# EasyEDA schematic flashlight-driver_2020-10-08_16-01-53.json
TITLE: Sheet_1; REV: 1.0; Date: 2020-08-26; Sheet: 1/1; Drawn By: Aleksi; Company: Your Company
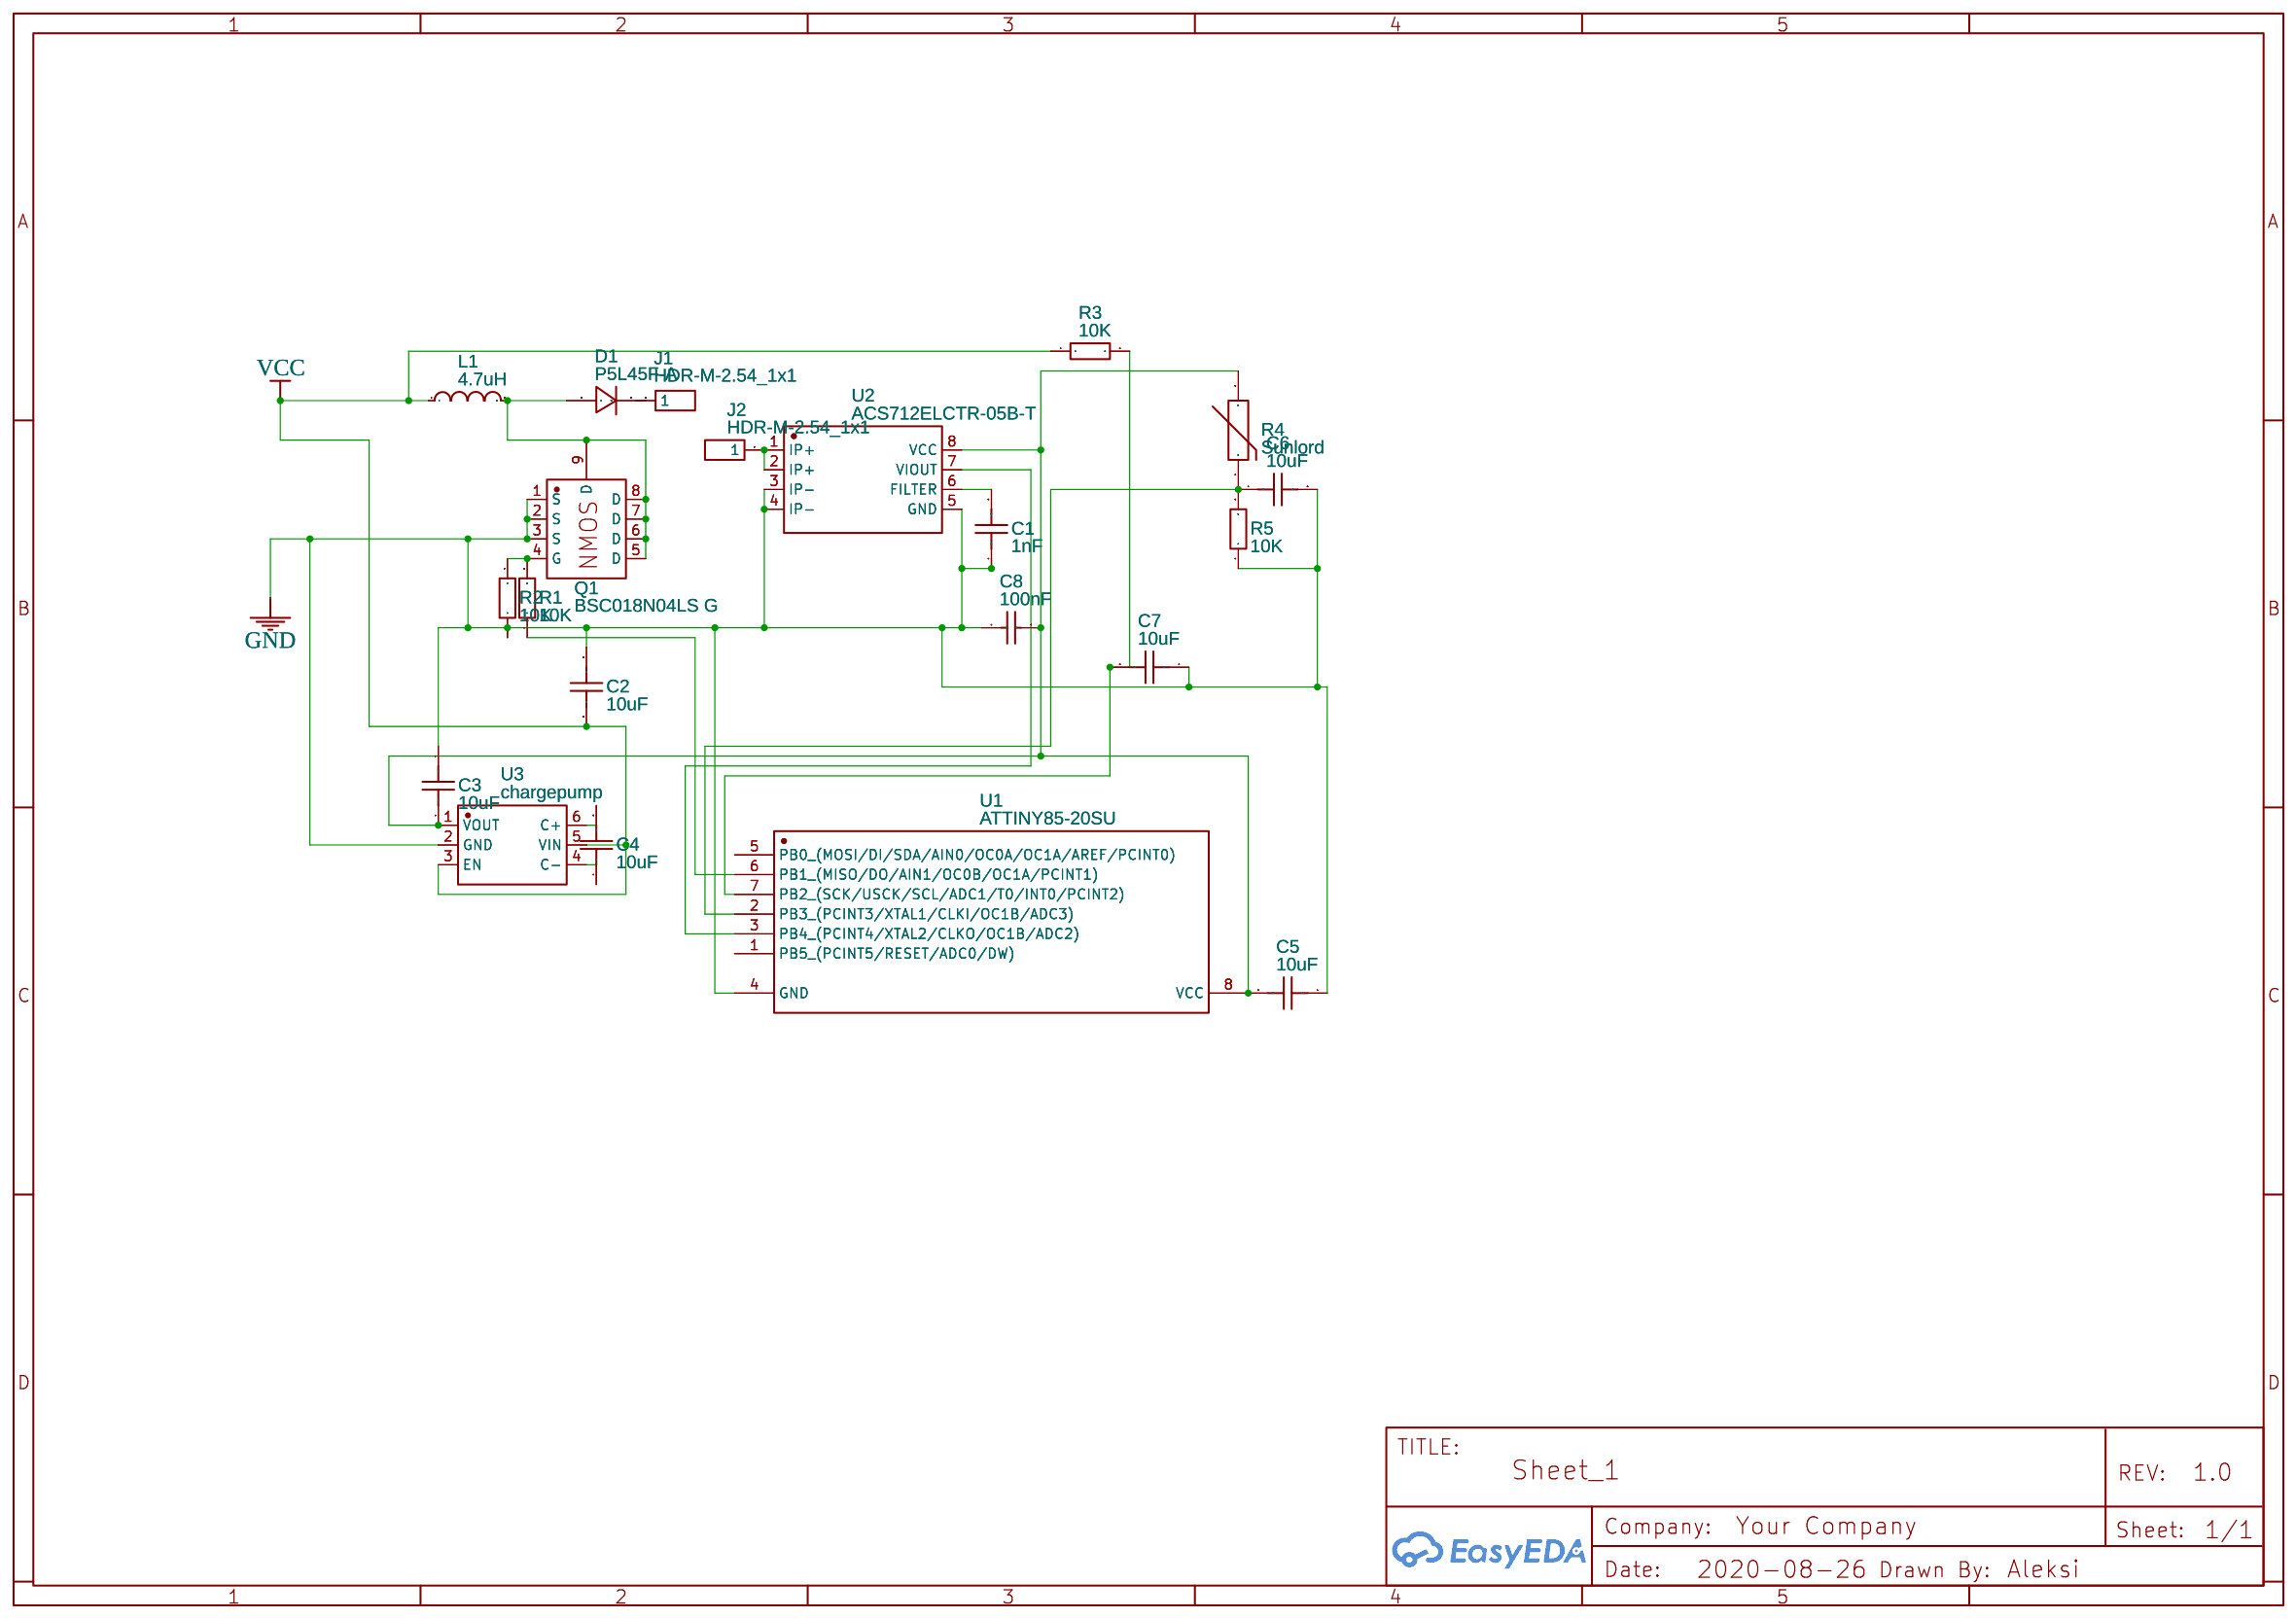
[diagram p0: schematic sheet]

## Parts
C1  1nF  [C0603]
C2  10uF  [C0603]
C3  10uF  [C0603]
C4  10uF  [C0603]
C5  10uF  [C0603]
C6  10uF  [C0603]
C7  10uF  [C0603]
C8  100nF  [C0603]
D1  P5L45F-A  [SMAF_L3.5-W2.6-LS4.7-FD]
J1  HDR-M-2.54_1x1  [HDR-M-2.54_1X1]
J2  HDR-M-2.54_1x1  [HDR-M-2.54_1X1]
L1  4.7uH  [IND-SMD_L13.8-W12.6_MHCC12050]
Q1  BSC018N04LS G  [PG-TDSON-8_L5.0-W6.0-P1.27-LS6.2-BL-EP]
R1  10K  [R0603]
R2  10K  [R0603]
R3  10K  [R0603]
R4  Sunlord  [R0603]
R5  10K  [R0603]
U1  ATTINY85-20SU  [SOIC-8_L5.3-W5.3-P1.27-LS8.0-BL]
U2  ACS712ELCTR-05B-T  [SOIC-8_L5.0-W4.0-P1.27-LS6.0-BL]
U3  chargepump  [SOT-23-6_L2.9-W1.6-P0.95-LS2.8-TL]

## Library data of the parts
C1 = GRM188R11H102KA01D: Supplier: LCSC; Manufacturer: MuRata; Supplier Part: C86007
C2-C7 = CL10A106KP8NNNC: Supplier: LCSC; Manufacturer: SAMSUNG; LCSC Assembly: Yes; Supplier Part: C19702; SMT Type: Basic
C8 = C0603C104K5RACAUTO: Supplier: LCSC; Manufacturer: KEMET; Supplier Part: C129621
D1 = P5L45F-A: Supplier: LCSC; Supplier Part: C255362; Manufacturer: PFC Device; Contributor: LCSC
J1 J2 = HDR-M-2.54_1x1: Supplier Part: C81276; Supplier: LCSC; Contributor: LCEDA_Lib
L1 = TMAX-1365-4R7-M: Supplier: LCSC; Supplier Part: C429830; Manufacturer: TDG; Contributor: LCSC
Q1 = BSC018N04LS G: Supplier: LCSC; Supplier Part: C534297; Manufacturer: Infineon Technologies; Contributor: LCSC
R1-R3 R5 = TC0350D1002T5E: Supplier: LCSC; Manufacturer: UniOhm; Supplier Part: C64266; LCSC Assembly: Yes; SMT Type: Extend
R4 = SDNT1608X103F3950FTF: Supplier: LCSC; Supplier Part: C279936; Contributor: LCSC
U1 = ATTINY85-20SU: Supplier: LCSC; Manufacturer: MICROCHIP; Supplier Part: C89852; LCSC Assembly: Yes; SMT Type: Extend
U2 = ACS712ELCTR-05B-T: Supplier: LCSC; Manufacturer: ALLEGRO; image: //image.lceda.cn/szlcsc/C44471.jpg; Supplier Part: C44471; LCSC Assembly: Yes; SMT Type: Extend
U3 = chargepump: Manufacturer: china; Manufacturer Part: 10A45; Supplier: EBAY; Supplier Part: 10A45; Contributor: Aleksi Laine

## Nets
GND: C1.1 C2.2 C3.2 C5.1 C6.2 C7.1 C8.1 Q1.1(S) Q1.2(S) Q1.3(S) R2.1 R5.1 U1.4(GND) U2.3(IP-) U2.4(IP-) U2.5(GND) U3.2(GND)
VCC: C2.1 L1.1 R3.1 U3.3(EN) U3.5(VIN)
Net-(C1-2): C1.2 U2.6(FILTER)
Net-(C3-1): C3.1 C5.2 C8.2 R4.2 U1.8(VCC) U2.8(VCC) U3.1(VOUT)
Net-(C4-1): C4.1 U3.4(C-)
Net-(C4-2): C4.2 U3.6(C+)
Net-(C6-1): C6.1 R4.1 R5.2 U1.2(PB3 (PCINT3/XTAL1/CLKI/OC1B/ADC3))
Net-(C7-2): C7.2 R3.2 U1.7(PB2 (SCK/USCK/SCL/ADC1/T0/INT0/PCINT2))
Net-(D1-1): D1.1(A) L1.2 Q1.5(D) Q1.6(D) Q1.7(D) Q1.8(D) Q1.9(D)
Net-(J2-1): J2.1 U2.1(IP+) U2.2(IP+)
Net-(Q1-4): Q1.4(G) R1.2 R2.2
Net-(R1-1): R1.1 U1.6(PB1 (MISO/DO/AIN1/OC0B/OC1A/PCINT1))
Net-(U1-3): U1.3(PB4 (PCINT4/XTAL2/CLKO/OC1B/ADC2)) U2.7(VIOUT)

Not connected (* = marked no-connect by the designer): D1 2(C); J1 1; U1 1(PB5 (PCINT5/RESET/ADC0/DW)) 5(PB0 (MOSI/DI/SDA/AIN0/OC0A/OC1A/AREF/PCINT0))
